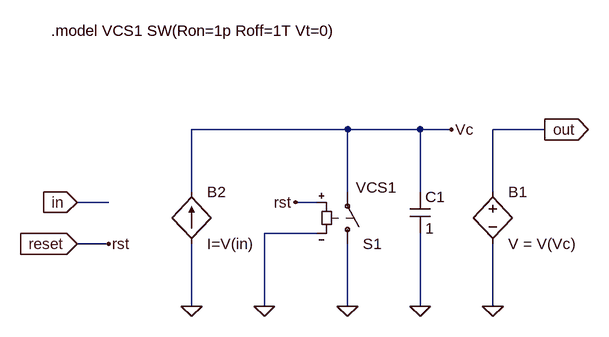
[diagram p0: schematic Integrator_reset.asc]
Integrator_reset.asc, the LTspice schematic file:
Version 4
SHEET 1 880 680
WIRE 432 32 192 32
WIRE 544 32 432 32
WIRE 592 32 544 32
WIRE 736 32 656 32
WIRE 192 128 192 32
WIRE 432 128 432 32
WIRE 544 128 544 32
WIRE 656 128 656 32
WIRE 64 144 16 144
WIRE 384 144 352 144
WIRE 384 192 304 192
WIRE 64 208 16 208
WIRE 192 304 192 208
WIRE 304 304 304 192
WIRE 432 304 432 208
WIRE 544 304 544 192
WIRE 656 304 656 208
FLAG 16 144 in
IOPIN 16 144 In
FLAG 656 304 0
FLAG 736 32 out
IOPIN 736 32 Out
FLAG 192 304 0
FLAG 544 304 0
FLAG 592 32 Vc
FLAG 16 208 reset
IOPIN 16 208 In
FLAG 304 304 0
FLAG 64 208 rst
FLAG 352 144 rst
FLAG 432 304 0
SYMBOL bv 656 112 R0
SYMATTR InstName B1
SYMATTR Value V = V(Vc)
SYMBOL bi2 192 128 R0
SYMATTR InstName B2
SYMATTR Value I=V(in)
SYMBOL cap 528 128 R0
SYMATTR InstName C1
SYMATTR Value 1
SYMBOL sw 432 224 M180
WINDOW 3 13 103 Left 0
SYMATTR Value VCS1
SYMATTR InstName S1
TEXT -24 -120 Left 0 !.model VCS1 SW(Ron=1p Roff=1T Vt=0)

The netlist it stands for:
* Integrator_reset.asc
B1 out 0 V = V(Vc)
B2 0 Vc I=V(in)
C1 Vc 0 1
S1 0 Vc rst 0 VCS1
.model VCS1 SW(Ron=1p Roff=1T Vt=0)
.backanno
.end